# EAGLE design RPiXBee (EAGLE 7.6.0)
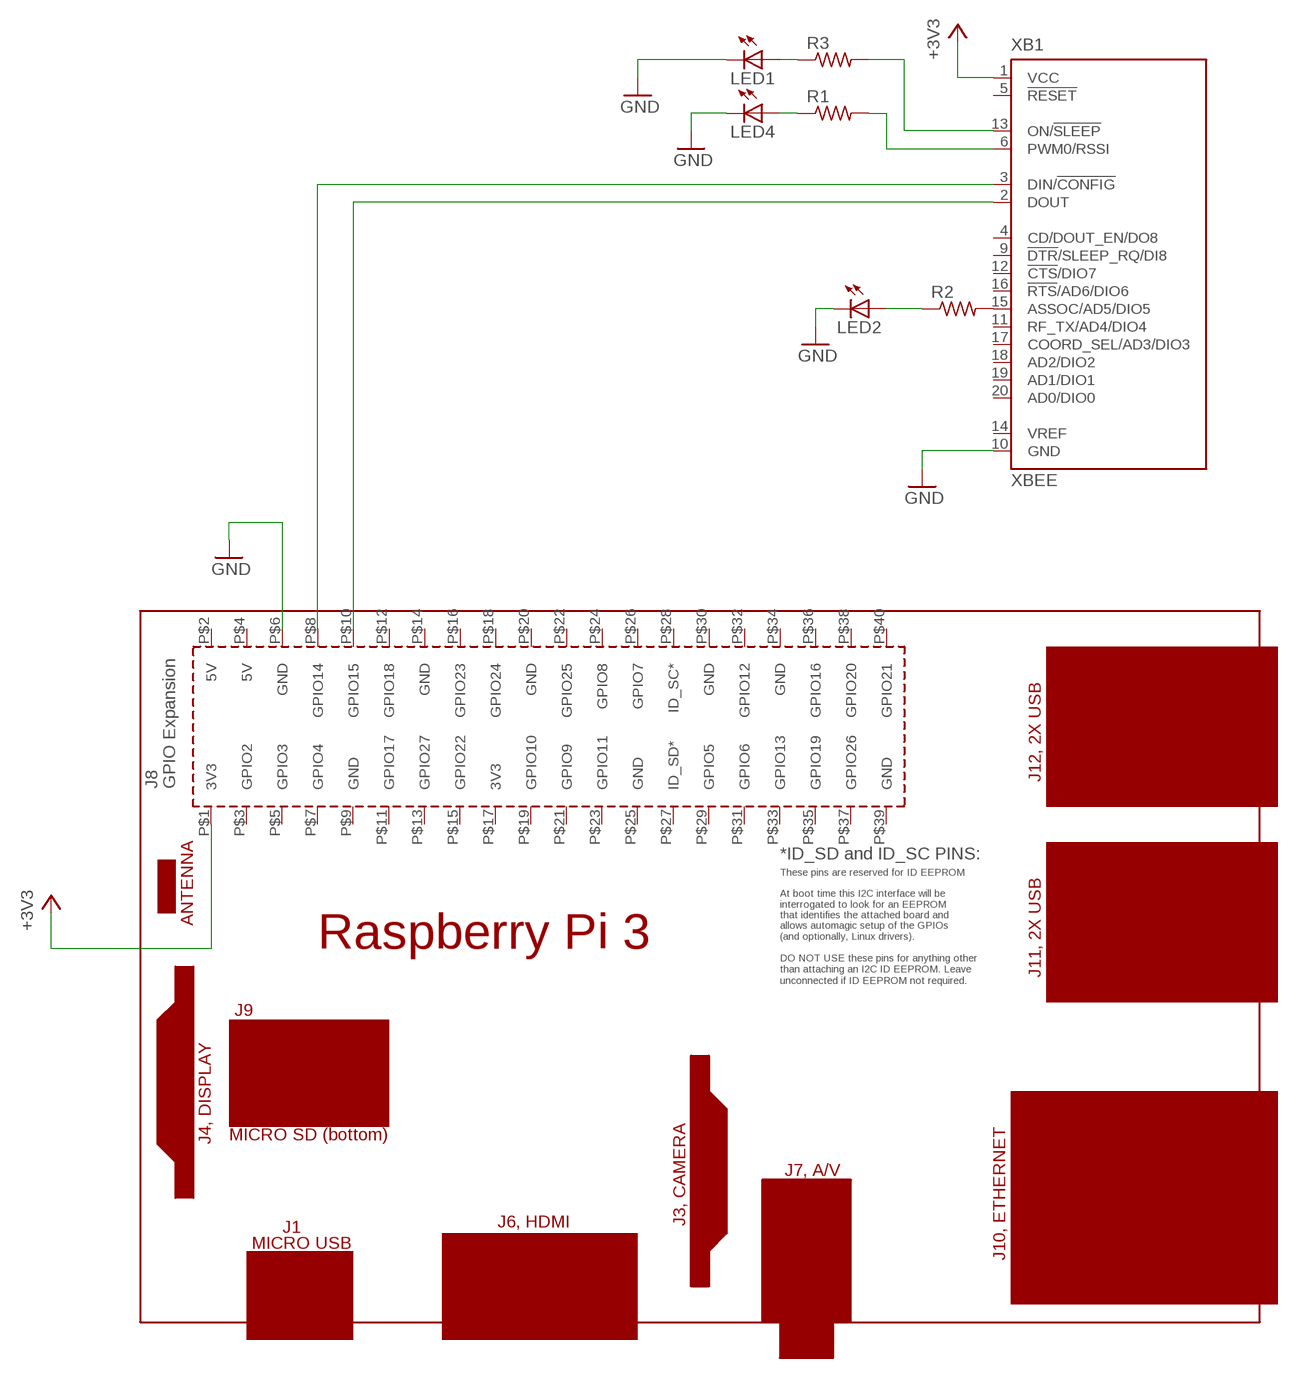
[diagram p0: schematic, sheet 1]

## Parts
LED1  LEDCHIP-LED0603  [CHIP-LED0603]
LED2  LEDCHIP-LED0603  [CHIP-LED0603]
LED4  LEDCHIP-LED0603  [CHIP-LED0603]
PCB1  RPI3NO-CONNECTORS  [RPI3-NO-CONNECTORS]
R1  R-US_R0603  [R0603]
R2  R-US_R0603  [R0603]
R3  R-US_R0603  [R0603]
XB1  XBEE  [XBEE]

## Nets
+3V3: PCB1.P$1(3V3) XB1.1(VCC)
GND: LED1.C LED2.C LED4.C PCB1.P$6(GND) XB1.10(GND)
N$1: R1.2 XB1.6(PWM0/RSSI)
N$2: R2.2 XB1.15(ASSOC/AD5/DIO5)
N$3: LED4.A R1.1
N$4: R3.2 XB1.13(ON/!SLEEP)
N$5: LED1.A R3.1
N$6: LED2.A R2.1
RPIRX-XBEEDOUT: PCB1.P$10(GPIO15) XB1.2(DOUT)
RPITX-XBEEDIN: PCB1.P$8(GPIO14) XB1.3(DIN/!CONFIG)
Unconnected: PCB1.P$2(5V) PCB1.P$3(GPIO2) PCB1.P$4(5V) PCB1.P$5(GPIO3) PCB1.P$7(GPIO4) PCB1.P$9(GND) PCB1.P$11(GPIO17) PCB1.P$12(GPIO18) PCB1.P$13(GPIO27) PCB1.P$14(GND) PCB1.P$15(GPIO22) PCB1.P$16(GPIO23) PCB1.P$17(3V3) PCB1.P$18(GPIO24) PCB1.P$19(GPIO10) PCB1.P$20(GND) PCB1.P$21(GPIO9) PCB1.P$22(GPIO25) PCB1.P$23(GPIO11) PCB1.P$24(GPIO8) PCB1.P$25(GND) PCB1.P$26(GPIO7) PCB1.P$27(ID_SD*) PCB1.P$28(ID_SC*) PCB1.P$29(GPIO5) PCB1.P$30(GND) PCB1.P$31(GPIO6) PCB1.P$32(GPIO12) PCB1.P$33(GPIO13) PCB1.P$34(GND) PCB1.P$35(GPIO19) PCB1.P$36(GPIO16) PCB1.P$37(GPIO26) PCB1.P$38(GPIO20) PCB1.P$39(GND) PCB1.P$40(GPIO21) XB1.4(CD/DOUT_EN/DO8) XB1.5(!RESET) XB1.9(!DTR!/SLEEP_RQ/DI8) XB1.11(RF_TX/AD4/DIO4) XB1.12(!CTS!/DIO7) XB1.14(VREF) XB1.16(!RTS!/AD6/DIO6) XB1.17(COORD_SEL/AD3/DIO3) XB1.18(AD2/DIO2) XB1.19(AD1/DIO1) XB1.20(AD0/DIO0)

## Library data of the parts
LED1 LED2 LED4 = led:LED: LED OSRAM: - CHIPLED LG R971, LG N971, LY N971, LG Q971, LY Q971, LO R971, LY R971 LH N974, LH R974 LS Q976, LO Q976, LY Q976 LO Q996 - Hyper CHIPLED LW Q18S LB Q993, LB Q99A, LB R99A - SideLED LS A670, LO A670, LY A670, LG A670, LP A670 LB A673, LV A673, LT A673, LW A673 LH A674 LY A675 LS A676, LA A676, LO A676, LY A676, LW A676 LS A679, LY A679, LG A679 - Hyper Micro SIDELED® LS Y876, LA Y876, LO Y876, LY Y876 LT Y87S - SmartLED LW L88C, LW L88S LB L89C, LB L89S, LG L890 LS L89K, LO L89K, LY L89K LS L896, LA L896, LO L896, LY L896 - TOPLED LS T670, LO T670, LY T670, LG T670, LP T670 LSG T670, LSP T670, LSY T670, LOP T670, LYG T670 LG T671, LOG T671, LSG T671 LB T673, LV T673, LT T673, LW T673 LH T674 LS T676, LA T676, LO T676, LY T676, LB T676, LH T676, LSB T676, LW T676 LB T67C, LV T67C, LT T67C, LS T67K, LO T67K, LY T67K, LW E67C LS E67B, LA E67B, LO E67B, LY E67B, LB E67C, LV E67C, LT E67C LW T67C LS T679, LY T679, LG T679 LS T770, LO T770, LY T770, LG T770, LP T770 LB T773, LV T773, LT T773, LW T773 LH T774 LS E675, LA E675, LY E675, LS T675 LS T776, LA T776, LO T776, LY T776, LB T776 LHGB T686 LT T68C, LB T68C - Hyper Mini TOPLED® LB M676 - Mini TOPLED Santana® LG M470 LS M47K, LO M47K, LY M47K Source: http://www.osram.convergy.de LUXEON: - LUMILED® LXK2-PW12-R00, LXK2-PW12-S00, LXK2-PW14-U00, LXK2-PW14-V00 LXK2-PM12-R00, LXK2-PM12-S00, LXK2-PM14-U00 LXK2-PE12-Q00, LXK2-PE12-R00, LXK2-PE12-S00, LXK2-PE14-T00, LXK2-PE14-U00 LXK2-PB12-K00, LXK2-PB12-L00, LXK2-PB12-M00, LXK2-PB14-N00, LXK2-PB14-P00, LXK2-PB14-Q00 LXK2-PR12-L00, LXK2-PR12-M00, LXK2-PR14-Q00, LXK2-PR14-R00 LXK2-PD12-Q00, LXK2-PD12-R00, LXK2-PD12-S00 LXK2-PH12-R00, LXK2-PH12-S00 LXK2-PL12-P00, LXK2-PL12-Q00, LXK2-PL12-R00 Source: www.luxeon.com KINGBRIGHT: KA-3528ASYC Source: www.kingbright.com
PCB1 = e14_Rpi3_RevA:RPI3: Device for Raspberry Pi 3 board created by Dave Young for www.element14.com More information and support community is available at https://www.element14.com/community/community/raspberry-pi
R1-R3 = resistor:R-US_: RESISTOR, American symbol
XB1 = maxstream:XBEE: XBee (TM) /XBee-PRO(TM) OEM RF Modules Source: MaxStream, Inc. xbee_productmanual.pdf; MPN: XBP24-Z7UIT-004; OC_FARNELL: 1751799; OC_NEWARK: 34R5507

## Board
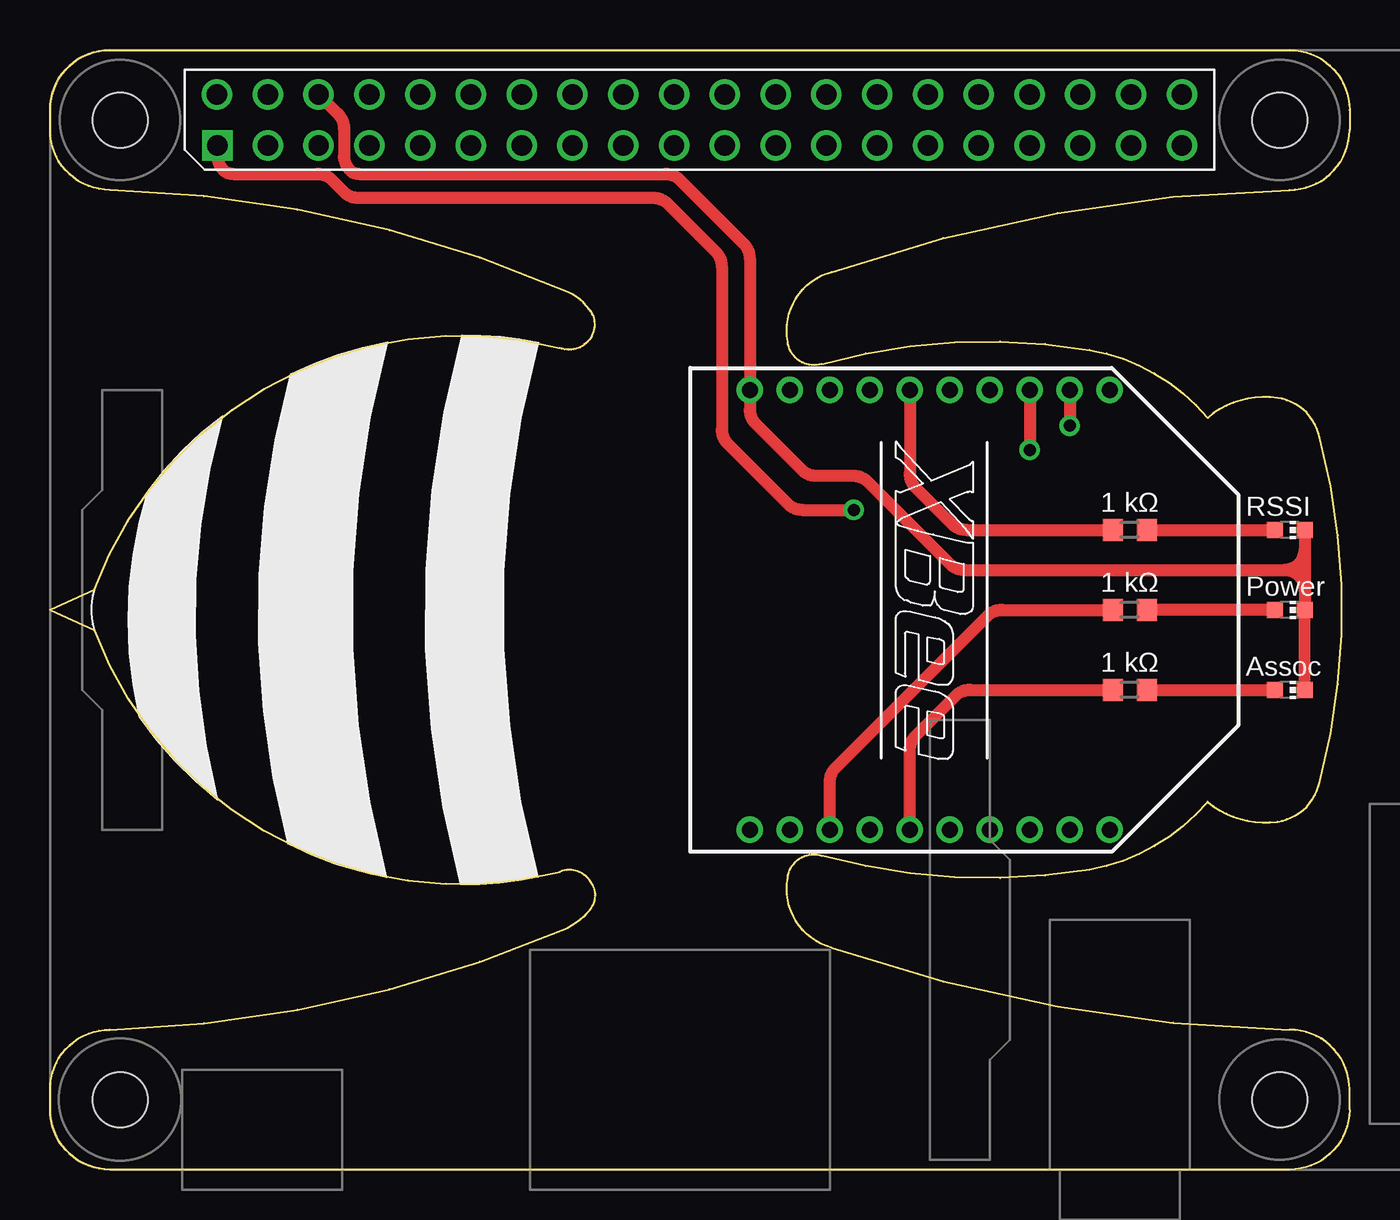
[diagram p1: board, top side]
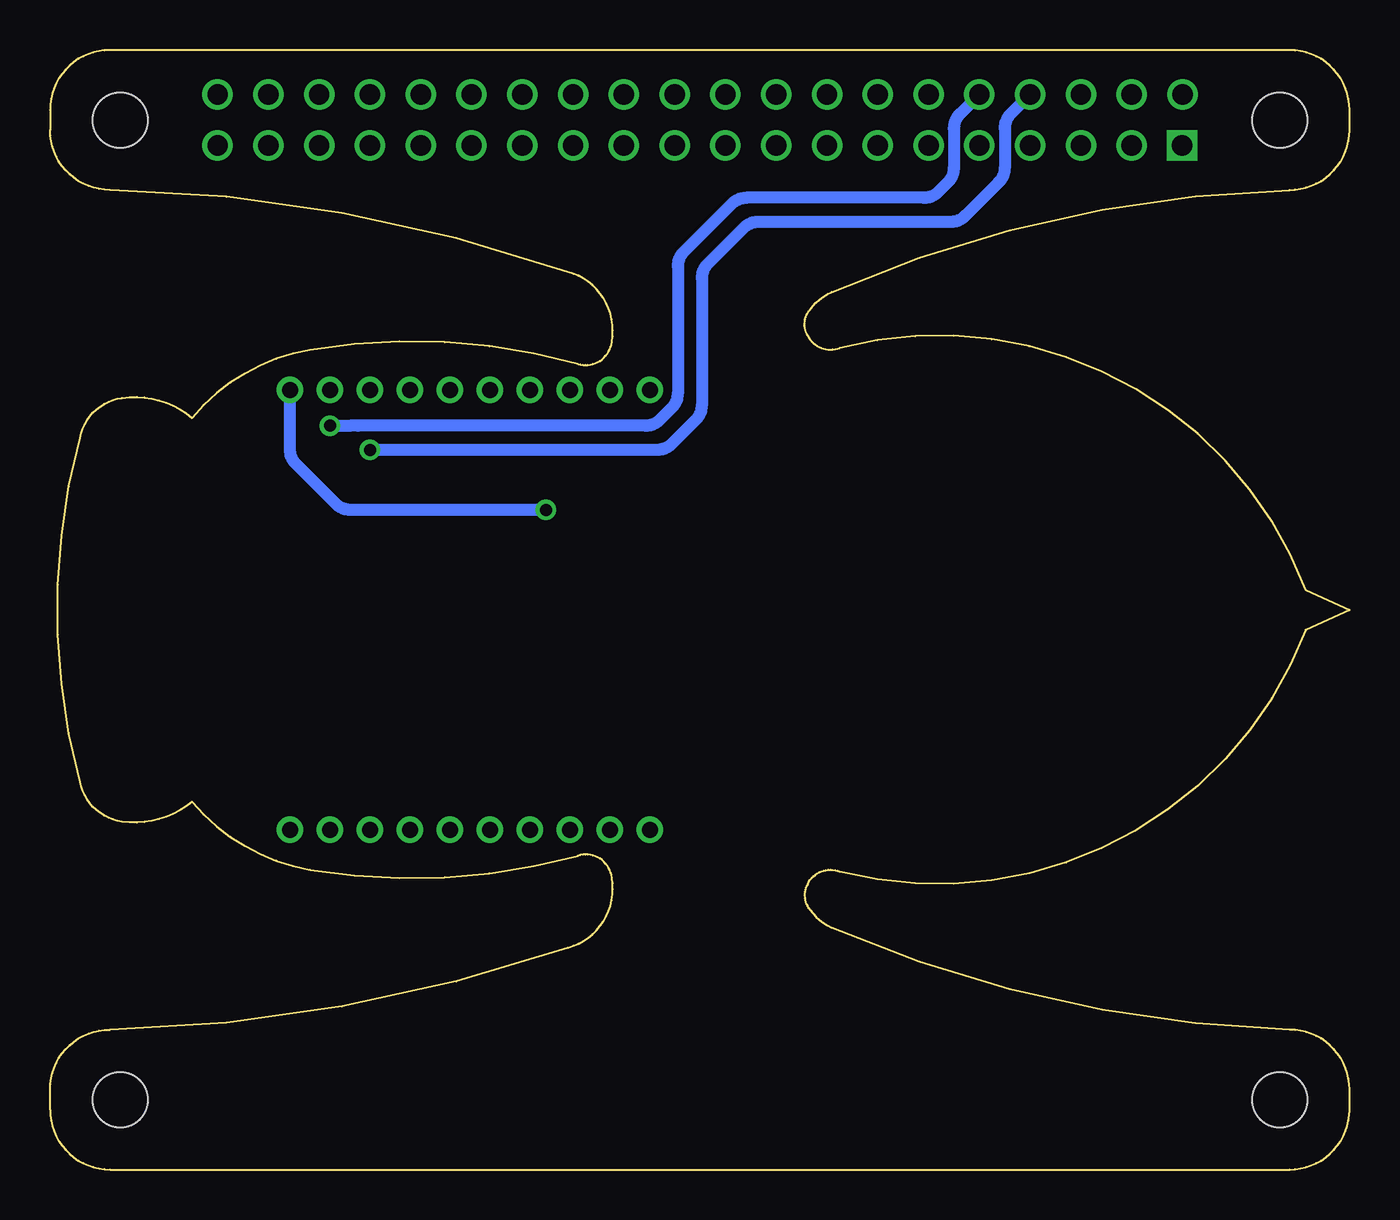
[diagram p2: board, bottom side, seen from below]

Size 65 x 56 mm. Coordinates in mm from the lower left corner, seen from the top.
Outline: 0,52 0,53 arc-90 3,56 62,56 arc-90 65,53 65,52 arc-90 62,49 arc18 39.1,44.9 arc85 36.9,41.4 arc101 38.6,40.3 arc-25 52,41 arc-40 57.9,37.6 arc-48 61.4,38.6 arc-71 63.5,36.6 arc-30 63.5,19.4 arc-71 61.4,17.4 arc-48 57.9,18.4 arc-40 52,15 arc-25 38.6,15.7 arc101 36.9,14.6 arc85 39.1,11.1 arc18 62,7 arc-90 65,4 65,3 arc-90 62,0 3,0 arc-90 0,3 0,4 arc-90 3,7 arc22 25.9,12.1 arc28 27,13 arc70 27.1,14.3 arc85 25.5,14.9 arc-84 2.2,27 0,28 2.2,29 arc-84 25.5,41.1 arc85 27.1,41.7 arc70 27,43 arc28 25.9,43.9 arc22 3,49 arc-90 0,52
Copper layers (1*16): Top 0.035mm / dielectric 1.5mm / Bottom 0.035mm
Design rules "default": minimum track width 10mil, minimum drill 24mil, track to track 8mil, track to pad 8mil, pad to pad 8mil, via to via 8mil, smd to smd 8mil, copper to edge 40mil, drill to drill 8mil, minimum pad ring 10mil, minimum via ring 8mil, stop-mask expansion 4mil, vias tented up to drill 0mil, thermal gap 10mil

### Footprints (pad centres in the part's own frame; a part is rotated, then mirrored left to right if it is on the bottom)
CHIP-LED0603 = smd 0.8 x 0.8: A 0,-0.75; C 0,0.75
RPI3-NO-CONNECTORS = drill 1.016 square: P$1 8.37,51.23 | drill 1.016: P$2 8.357,53.772; P$3 10.897,51.232; P$4 10.897,53.772; P$5 13.437,51.232; P$6 13.437,53.772; P$7 15.977,51.232; P$8 15.977,53.772; P$9 18.517,51.232; P$10 18.517,53.772; P$11 21.057,51.232; P$12 21.057,53.772; P$13 23.597,51.232; P$14 23.597,53.772; P$15 26.137,51.232; P$16 26.137,53.772; P$17 28.677,51.232; P$18 28.677,53.772; P$19 31.217,51.232; P$20 31.217,53.772; P$21 33.757,51.232; P$22 33.757,53.772; P$23 36.297,51.232; P$24 36.297,53.772; P$25 38.837,51.232; P$26 38.837,53.772; P$27 41.377,51.232; P$28 41.377,53.772; P$29 43.917,51.232; P$30 43.917,53.772; P$31 46.457,51.232; P$32 46.457,53.772; P$33 48.997,51.232; P$34 48.997,53.772; P$35 51.537,51.232; P$36 51.537,53.772; P$37 54.077,51.232; P$38 54.077,53.772; P$39 56.617,51.232; P$40 56.617,53.772 | hole 2.75: 3.5,3.5; 61.5,3.5; 3.5,52.5; 61.5,52.5
R0603 = smd 1 x 1.1: 1 -0.85,0; 2 0.85,0
XBEE = drill 0.8 pad 1.27: 1 -11,9; 2 -11,7; 3 -11,5; 4 -11,3; 5 -11,1; 6 -11,-1; 7 -11,-3; 8 -11,-5; 9 -11,-7; 10 -11,-9; 11 11,-9; 12 11,-7; 13 11,-5; 14 11,-3; 15 11,-1; 16 11,1; 17 11,3; 18 11,5; 19 11,7; 20 11,9

### Placement (x,y rotation side)
LED1  62,28 270 top
LED2  62,24 270 top
LED4  62,32 270 top
PCB1  0,0 0 top
R1  54,32 180 top
R2  54,24 180 top
R3  54,28 180 top
XB1  44,28 270 top

### Tracks (layer width: path | path; a pad name or v marks a point on that pad's centre or on a via)
+3V3  (via drill 0.6)
  Top 0.6: PCB1.P$1 8.37,50.71 arc45 8.66,50 arc45 9.15,49.8 13.39,49.8 arc-45 14.09,49.51 14.71,48.89 arc45 15.41,48.6 30.19,48.6 arc-45 30.89,48.31 33.31,45.89 arc-45 33.6,45.19 33.6,37.01 arc45 33.89,36.31 36.91,33.29 arc45 37.61,33 v40.2,33
  Bottom 0.6: v40.2,33 49.99,33 arc45 50.69,33.29 52.71,35.31 arc45 53,36.01 XB1.1
GND
  Top 0.6: PCB1.P$6 14.41,52.79 arc-45 14.71,52.09 14.71,50.7 arc45 15,49.99 arc45 15.46,49.8 30.79,49.8 arc-45 31.49,49.51 34.71,46.29 arc-45 35,45.59 XB1.10 35,38.01 arc45 35.29,37.31 37.61,34.99 arc45 38.31,34.7 40.19,34.7 arc-45 40.89,34.41 45.01,30.29 arc45 45.71,30 61.75,30 | 61.75,30 arc-90 62.75,29 | 61.75,30 arc90 62.75,31 | LED4.C 62.75,31 | 62.75,31 62.75,29 | 62.75,29 LED1.C LED2.C
N$1
  Top 0.6: XB1.6 43,34.81 arc45 43.29,34.11 45.11,32.29 arc45 45.81,32 R1.2
N$2
  Top 0.6: XB1.15 43,20.99 arc-45 43.29,21.69 45.31,23.71 arc-45 46.01,24 R2.2
N$3
  Top 0.6: R1.1 LED4.A
N$4
  Top 0.6: XB1.13 39,19.39 arc-45 39.29,20.09 46.91,27.71 arc-45 47.61,28 R3.2
N$5
  Top 0.6: LED1.A R3.1
N$6
  Top 0.6: R2.1 LED2.A
RPIRX-XBEEDOUT  (via drill 0.6)
  Top 0.6: XB1.2 v51,37.2
  Bottom 0.6: PCB1.P$10 19.5,52.79 arc-45 19.79,52.09 19.79,50.1 arc45 20.08,49.39 20.58,48.89 arc45 21.29,48.6 30.19,48.6 arc-45 30.89,48.31 33.31,45.89 arc-45 33.6,45.19 33.6,38.81 arc45 33.89,38.11 34.51,37.49 arc45 35.21,37.2 49.6,37.2 50,37.2 v51,37.2
RPITX-XBEEDIN  (via drill 0.6)
  Top 0.6: XB1.3 v49,36
  Bottom 0.6: PCB1.P$8 16.95,52.79 arc-45 17.25,52.09 17.25,50.1 arc45 17.54,49.39 19.24,47.69 arc45 19.95,47.4 29.59,47.4 arc-45 30.29,47.11 32.11,45.29 arc-45 32.4,44.59 32.4,38.21 arc45 32.69,37.51 33.91,36.29 arc45 34.61,36 v49,36

### Text on the board
tPlace: 1 kΩ | RSSI | 1 kΩ | Power | 1 kΩ | Assoc